# Altium schematic sheet Power2.schdoc
size 420 x 298 mm; Symbol: Sheet-Symbol_A4; Company: 嘉立创EDA; Version: V1.0; Page Size: A4; @Project Name: prj_extend_and_core_board; @Page Count: 7; @Update Date: 2024-07-05; @Create Date: 2024-06-16; @Schematic Name: Schematic1; @Page No: 7; @Page Name: Power2; Device: Sheet-Symbol_A4
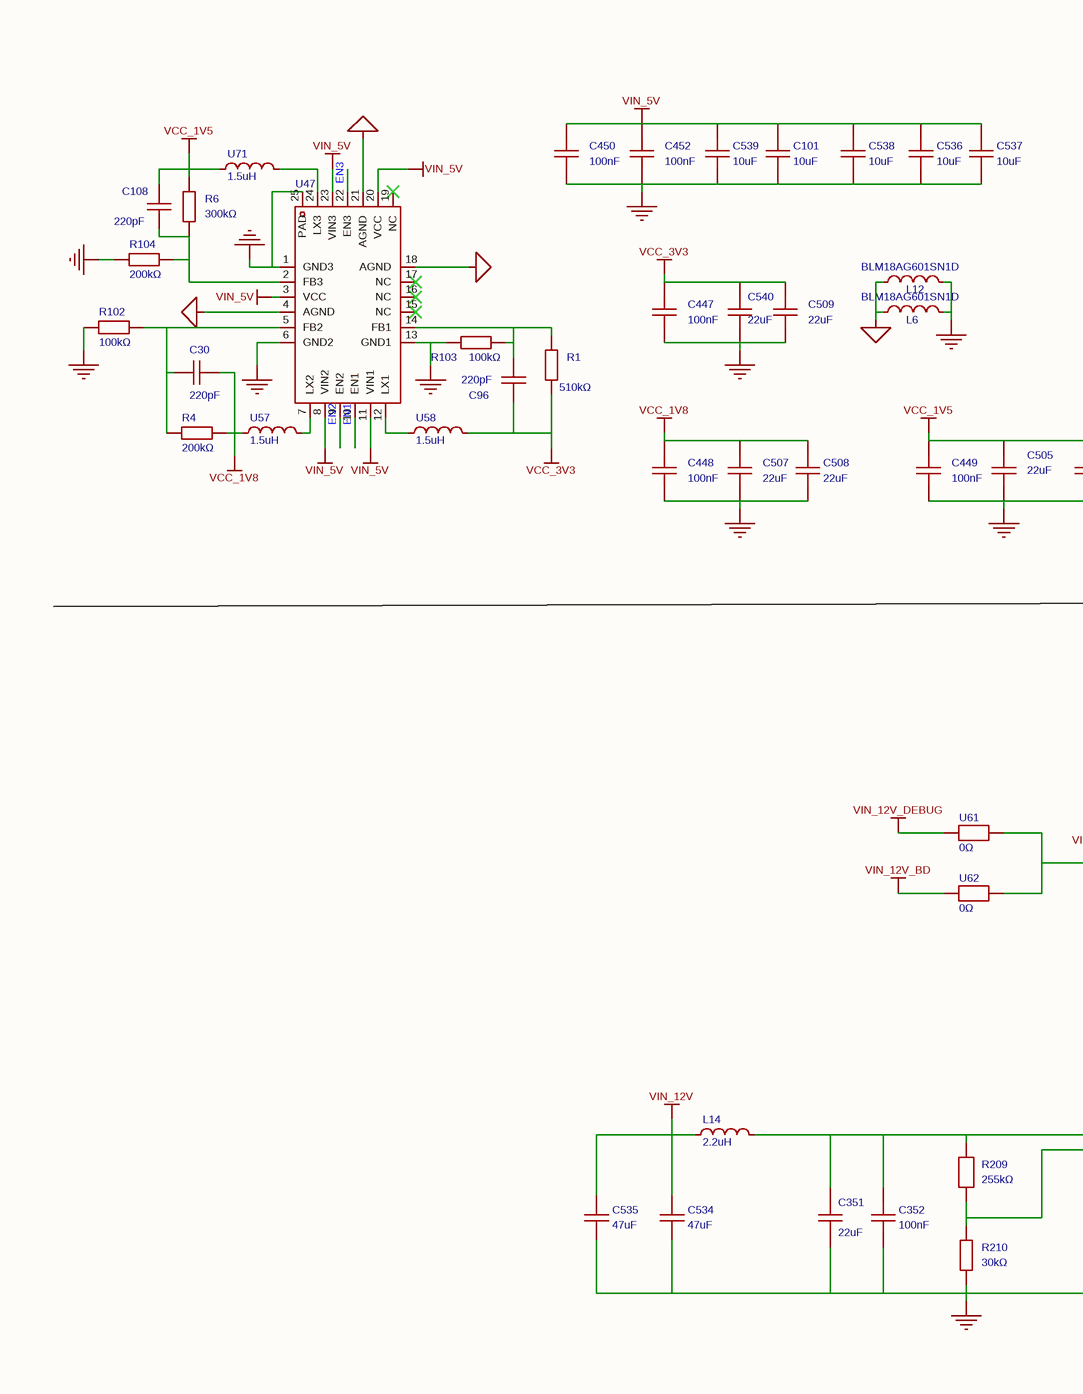
[diagram p0: Power2.schdoc, left]
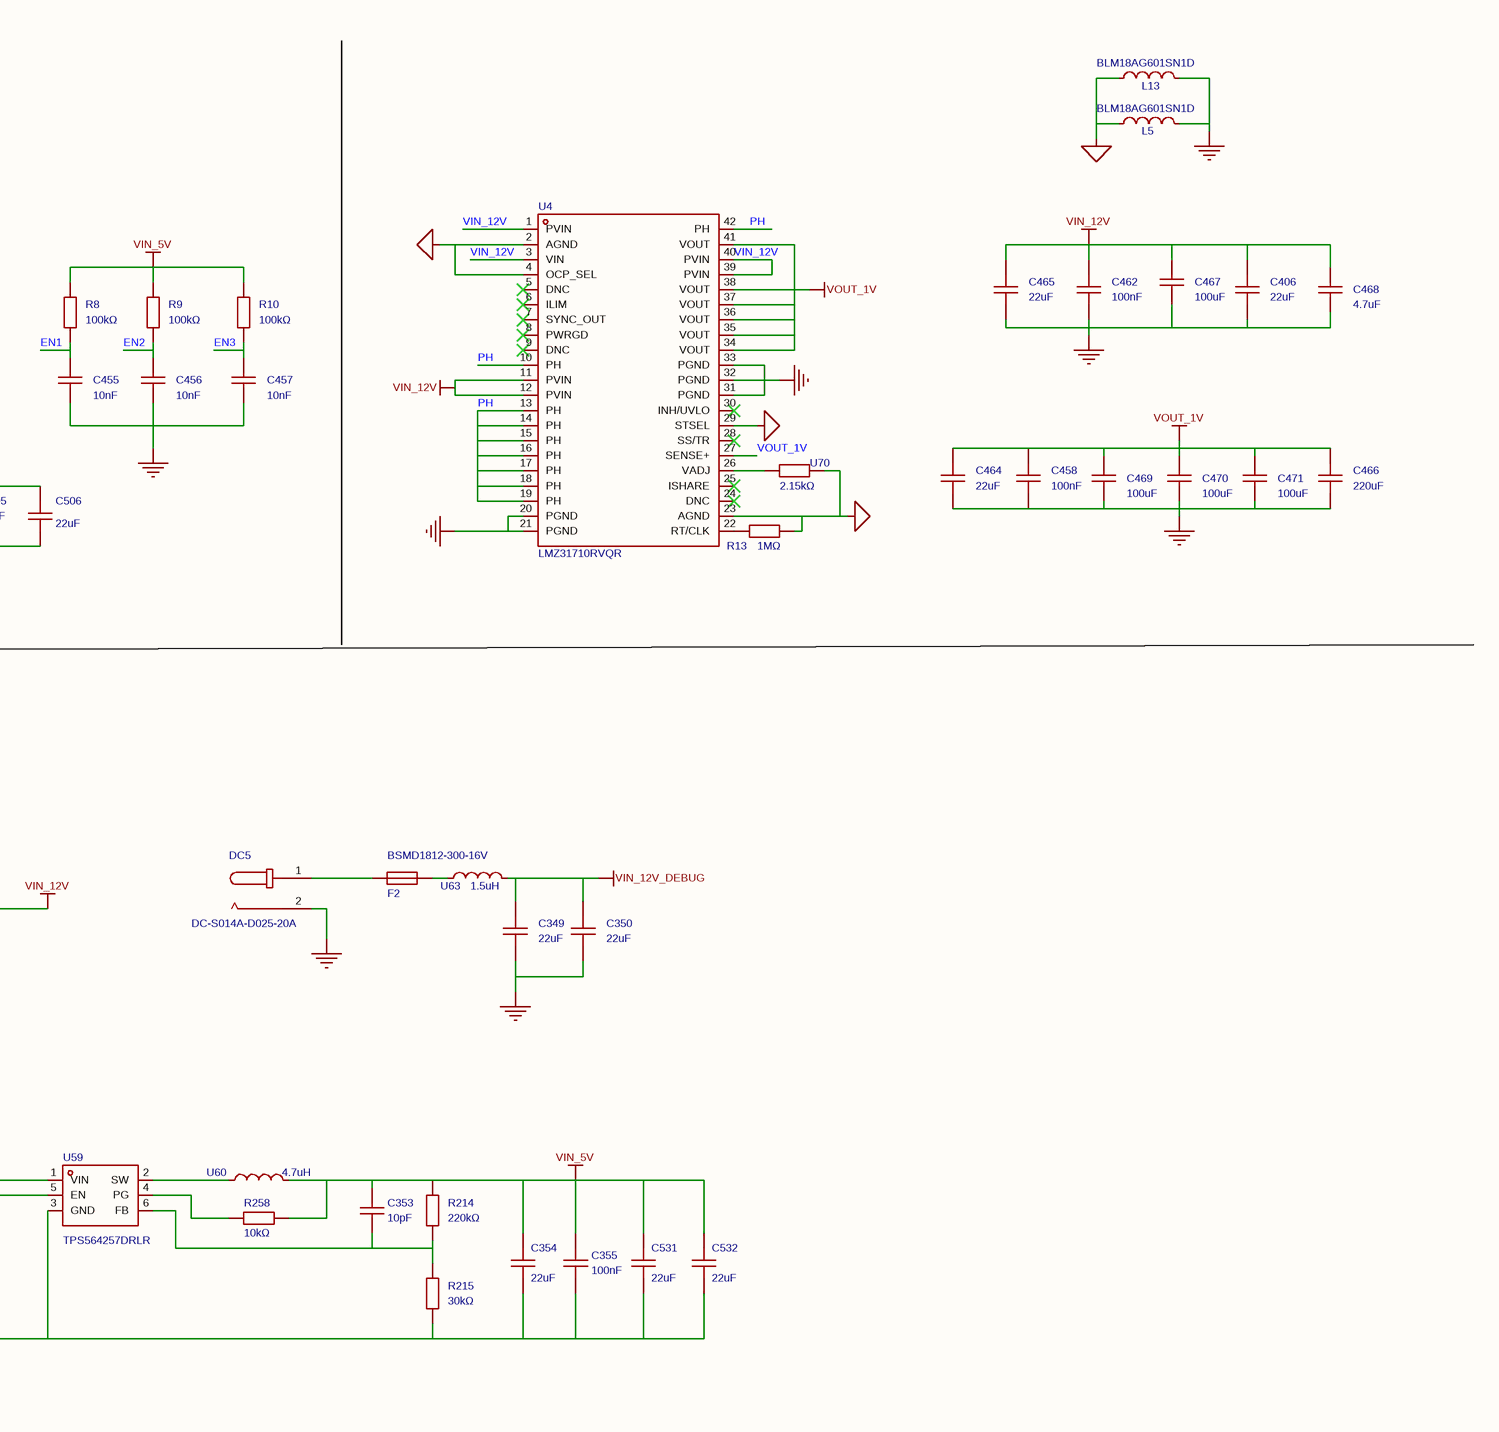
[diagram p1: Power2.schdoc, right]

## Parts
C30  220pF  [C0402]
C96  220pF  [C0402]
C101  10uF  [C0603]
C108  220pF  [C0402]
C349  22uF  [C0805]
C350  22uF  [C0805]
C351  22uF  [C0805]
C352  100nF  [C0603]
C353  10pF  [C0603]
C354  22uF  [C0805]
C355  100nF  [C0603]
C406  22uF  [C0805]
C447  100nF  [C0402]
C448  100nF  [C0402]
C449  100nF  [C0402]
C450  100nF  [C0402]
C452  100nF  [C0402]
C455  10nF  [C0402]
C456  10nF  [C0402]
C457  10nF  [C0402]
C458  100nF  [C0402]
C462  100nF  [C0402]
C464  22uF  [C0603]
C465  22uF  [C0805]
C466  220uF  [C1206]
C467  100uF  [C1206]
C468  4.7uF  [C0603]
C469  100uF  [C1206]
C470  100uF  [C1206]
C471  100uF  [C1206]
C505  22uF  [C0805]
C506  22uF  [C0805]
C507  22uF  [C0805]
C508  22uF  [C0805]
C509  22uF  [C0805]
C531  22uF  [C0805]
C532  22uF  [C0805]
C534  47uF  [C0603]
C535  47uF  [C0603]
C536  10uF  [C0603]
C537  10uF  [C0603]
C538  10uF  [C0603]
C539  10uF  [C0603]
C540  22uF  [C0805]
DC5  DC-S014A-D025-20A  [DC-IN-TH_DC-S014A-D025-20A]
F2  BSMD1812-300-16V  [F1812]
L5  BLM18AG601SN1D  [L0603]
L6  BLM18AG601SN1D  [L0603]
L12  BLM18AG601SN1D  [L0603]
L13  BLM18AG601SN1D  [L0603]
L14  2.2uH  [IND-SMD_L2.5-W2.0_FWP252012P-2R2ML]
R1  510kΩ  [R0603]
R4  200kΩ  [R0603]
R6  300kΩ  [R0603]
R8  100kΩ  [R0402]
R9  100kΩ  [R0402]
R10  100kΩ  [R0402]
R13  1MΩ  [R0603]
R102  100kΩ  [R0603]
R103  100kΩ  [R0603]
R104  200kΩ  [R0603]
R209  255kΩ  [R0805]
R210  30kΩ  [R0805]
R214  220kΩ  [R0805]
R215  30kΩ  [R0805]
R258  10kΩ  [R0603]
U4  LMZ31710RVQR  [B3QFN-42_L10.0-W10.0-P0.80-TL-EP]
U47  EA3059C  [QFN-24_L4.0-W4.0-P0.50-BL-EP2.6]  (value not drawn)
U57  1.5uH  [IND-SMD_L2.5-W2.0_YXMBL252010P]
U58  1.5uH  [IND-SMD_L2.5-W2.0_YXMBL252010P]
U59  TPS564257DRLR  [SOT-563-6_L1.6-W1.2-P0.5-LS1.6-BR]
U60  4.7uH  [IND-SMD_L2.5-W2.0-VLS252012CX-150M]
U61  0Ω  [R1812]
U62  0Ω  [R1812]
U63  1.5uH  [IND-SMD_L2.5-W2.0_YXMBL252010P]
U70  2.15kΩ  [R0603]
U71  1.5uH  [IND-SMD_L2.5-W2.0_YXMBL252010P]

## Nets
AGND: L5.1 L6.1 L12.1 L13.1 R13.2 U4.2(AGND) U4.4(OCP_SEL) U4.23(AGND) U4.29(STSEL) U47.4(AGND) U47.18(AGND) U47.21(AGND) U70.2
GND: C101.1 C349.1 C350.1 C351.1 C352.1 C354.1 C355.1 C406.1 C447.1 C448.1 C449.1 C450.1 C452.1 C455.1 C456.1 C457.1 C458.1 C462.1 C464.1 C465.1 C466.1 C467.1 C468.1 C469.1 C470.1 C471.1 C505.1 C506.1 C507.1 C508.1 C509.1 C531.1 C532.1 C534.1 C535.1 C536.1 C537.1 C538.1 C539.1 C540.1 DC5.2 L5.2 L6.2 L12.2 L13.2 R102.1 R103.1 R104.1 R210.1 R215.1 U4.20(PGND) U4.21(PGND) U4.31(PGND) U4.32(PGND) U4.33(PGND) U47.1(GND3) U47.6(GND2) U47.13(GND1) U47.25(PAD) U59.3(GND)
VCC_1V5: C108.1 C449.2 C505.2 C506.2 R6.2 U71.1
VCC_1V8: C30.1 C448.2 C507.2 C508.2 R4.2 U57.1
VCC_3V3: C96.1 C447.2 C509.2 C540.2 R1.1 U58.2
VIN_5V: C101.2 C353.2 C354.2 C355.2 C450.2 C452.2 C531.2 C532.2 C536.2 C537.2 C538.2 C539.2 R8.2 R9.2 R10.2 R214.2 R258.2 U47.3(VCC) U47.8(VIN2) U47.11(VIN1) U47.20(VCC) U47.23(VIN3) U60.2
VIN_12V: C406.2 C462.2 C465.2 C467.2 C468.2 C534.2 C535.2 L14.1 U4.1(PVIN) U4.3(VIN) U4.11(PVIN) U4.12(PVIN) U4.39(PVIN) U4.40(PVIN) U61.2 U62.2
VIN_12V_BD: U62.1
VIN_12V_DEBUG: C349.2 C350.2 U61.1 U63.2
VOUT_1V: C458.2 C464.2 C466.2 C469.2 C470.2 C471.2 U4.27(SENSE+) U4.34(VOUT) U4.35(VOUT) U4.36(VOUT) U4.37(VOUT) U4.38(VOUT) U4.41(VOUT)
EN1: C455.2 R8.1 U47.10(EN1)
EN2: C456.2 R9.1 U47.9(EN2)
EN3: C457.2 R10.1 U47.22(EN3)
PH: U4.10(PH) U4.13(PH) U4.14(PH) U4.15(PH) U4.16(PH) U4.17(PH) U4.18(PH) U4.19(PH) U4.42(PH)
NetC30_2: C30.2 R4.1 R102.2 U47.5(FB2)
NetC96_2: C96.2 R1.2 R103.2 U47.14(FB1)
NetC108_2: C108.2 R6.1 R104.2 U47.2(FB3)
NetC351_2: C351.2 C352.2 L14.2 R209.2 U59.1(VIN)
NetC353_1: C353.1 R214.1 R215.2 U59.6(FB)
NetDC5_1: DC5.1 F2.1
NetF2_2: F2.2 U63.1
NetR13_1: R13.1 U4.22(RT/CLK)
NetR209_1: R209.1 R210.2 U59.5(EN)
NetR258_1: R258.1 U59.4(PG)
NetU4_26: U4.26(VADJ) U70.1
NetU47_7: U47.7(LX2) U57.2
NetU47_12: U47.12(LX1) U58.1
NetU47_24: U47.24(LX3) U71.2
NetU59_2: U59.2(SW) U60.1

Not connected (* = marked no-connect by the designer): U4 5(DNC)* 6(ILIM)* 7(SYNC_OUT)* 8(PWRGD)* 9(DNC)* 24(DNC)* 25(ISHARE)* 28(SS/TR)* 30(INH/UVLO)*; U47 15(NC)* 16(NC)* 17(NC)* 19(NC)*

## Notes on the sheet
- 1
- 2
- 3
- 4
- 5
- 6
- A
- B
- C
- 更新日期
- 2024-07-05
- D
- 原理图
- 图页
- Schematic1
- Power2
- 创建日期
- 物料编码
- 2024-06-16
- 审阅
- 绘制
- prj_extend_and_core_board
- 版本
- V1.0
- 尺寸
- A4
- 页
- 7
- 嘉立创EDA
- 共

## Library data of the parts
C30 C96 C108 = 0402B221K500NT: 容值:220pF;精度:±10%;额定电压:50V;材质(温度系数):X7R;; Manufacturer: FH(风华); AddInBom: yes; ModelId: 36a51122f27c49738f86b3bfa98863e0; ModelName: C0402_L1.0-W0.5-H0.5; ModelTransform: 39.37,19.685,0,0,0,0,0,0,0; Tolerance: ±10%; Voltage Rated: 50V; Temperature Coefficient: X7R; Symbol: 0402B221K500NT; Device: 0402B221K500NT; LCSC Part Name: 220pF ±10% 50V; SupplierPart: C1530; ManufacturerPart: 0402B221K500NT; Supplier Footprint: 0402; JLCPCB Part Class: 基础库; Datasheet: https://atta.szlcsc.com/upload/public/pdf/source/20200305/C486355_26A10D38EF8C2A5C37091D0039909270.pdf; Supplier: LCSC; ConvertToPcb: yes; FootprintName: C0402; Value: 220pF
C101 C536-C539 = CL10A106KP8NNNC: 容值:10uF;精度:±10%;额定电压:10V;材质(温度系数):X5R;; Manufacturer: SAMSUNG(三星); AddInBom: yes; ModelId: ac125912035d415993ca9572d50418b1; ModelName: C0603_L1.6-W0.8-H0.8; ModelTransform: 62.992,31.496,0,0,0,0,0,0,0; Tolerance: ±10%; Voltage Rated: 10V; Temperature Coefficient: X5R; Symbol: CL10A106KP8NNNC; Device: CL10A106KP8NNNC; Supplier: LCSC; Manufacturer Part: CL10A106KP8NNNC; Value: 10uF; Supplier Part: C19702; JLCPCB Part Class: 基础库; LCSC Part Name: 10uF ±10% 10V; Supplier Footprint: 0603; Datasheet: https://atta.szlcsc.com/upload/public/pdf/source/20160218/1457707763339.pdf; ConvertToPcb: yes; FootprintName: C0603
C349-C351 C354 C406 C465 C531 C532 = CL21A226MAQNNNE: 容值:22uF;精度:±20%;额定电压:25V;材质(温度系数):X5R;; Manufacturer: SAMSUNG(三星); AddInBom: yes; ModelId: 1ba041120af144c991958decab20d241; ModelName: C0805_L2.0-W1.3-H1.3; ModelTransform: 78.74,51.181,0,0,0,0,0,0.0005,0; Tolerance: ±20%; Voltage Rated: 25V; Temperature Coefficient: X5R; Symbol: CL21A226MAQNNNE; Device: CL21A226MAQNNNE; LCSC Part Name: 22uF ±20% 25V; SupplierPart: C45783; ManufacturerPart: CL21A226MAQNNNE; Supplier Footprint: 0805; JLCPCB Part Class: 基础库; Datasheet: https://atta.szlcsc.com/upload/public/pdf/source/20160218/1457707763339.pdf; Supplier: LCSC; ConvertToPcb: yes; FootprintName: C0805; Value: 22uF
C352 C355 = CC0603KRX7R9BB104: 容值:100nF;精度:±10%;额定电压:50V;材质(温度系数):X7R;; Manufacturer: YAGEO(国巨); AddInBom: yes; ModelId: ac125912035d415993ca9572d50418b1; ModelName: C0603_L1.6-W0.8-H0.8; ModelTransform: 62.992,31.496,0,0,0,0,0,0,0; Tolerance: ±10%; Voltage Rated: 50V; Temperature Coefficient: X7R; Symbol: CC0603KRX7R9BB104; Device: CC0603KRX7R9BB104; Supplier: LCSC; Manufacturer Part: CC0603KRX7R9BB104; Value: 100nF; Supplier Part: C14663; JLCPCB Part Class: Basic Part; LCSC Part Name: 100nF ±10% 50V; Supplier Footprint: 0603; Datasheet: https://atta.szlcsc.com/upload/public/pdf/source/20180910/C282072_33301C7F631E79921B82A8DAC6BCC5B3.pdf; ConvertToPcb: yes; FootprintName: C0603
C353 = CL10C100JB8NNNC: 容值:10pF;精度:±5%;额定电压:50V;材质(温度系数):C0G;; Manufacturer: SAMSUNG(三星); AddInBom: yes; ModelId: ac125912035d415993ca9572d50418b1; ModelName: C0603_L1.6-W0.8-H0.8; ModelTransform: 62.992,31.496,0,0,0,0,0,0,0; Tolerance: ±5%; Voltage Rated: 50V; Temperature Coefficient: C0G; Symbol: CL10C100JB8NNNC; Device: CL10C100JB8NNNC; Supplier: LCSC; Manufacturer Part: CL10C100JB8NNNC; Value: 10pF; Supplier Part: C1634; JLCPCB Part Class: 基础库; LCSC Part Name: 10pF ±5% 50V; Supplier Footprint: 0603; Datasheet: https://atta.szlcsc.com/upload/public/pdf/source/20160218/1457707763339.pdf; ConvertToPcb: yes; FootprintName: C0603
C447-C450 C452 C458 C462 = GRM155R71H104KE14D: 容值:100nF;精度:±10%;额定电压:50V;材质(温度系数):X7R;; Manufacturer: muRata(村田); AddInBom: yes; ModelId: 36a51122f27c49738f86b3bfa98863e0; ModelName: C0402_L1.0-W0.5-H0.5; ModelTransform: 39.37,19.685,0,0,0,0,0,0,0; Tolerance: ±10%; Voltage Rated: 50V; Temperature Coefficient: X7R; Symbol: GRM155R71H104KE14D; Device: GRM155R71H104KE14D; Supplier: LCSC; Manufacturer Part: GRM155R71H104KE14D; Value: 100nF; Supplier Part: C77020; JLCPCB Part Class: 扩展库; LCSC Part Name: 100nF ±10% 50V; Supplier Footprint: 0402; Datasheet: https://atta.szlcsc.com/upload/public/pdf/source/20180326/C77020_39BD49C951FF1AF0DB1F1FAC5AC1E401.pdf; ConvertToPcb: yes; FootprintName: C0402
C455-C457 = CC0402KRX7R9BB103: 容值:10nF;精度:±10%;额定电压:50V;材质(温度系数):X7R;; Manufacturer: YAGEO(国巨); AddInBom: yes; ModelId: 36a51122f27c49738f86b3bfa98863e0; ModelName: C0402_L1.0-W0.5-H0.5; ModelTransform: 39.37,19.685,0,0,0,0,0,0,0; Tolerance: ±10%; Voltage Rated: 50V; Temperature Coefficient: X7R; Symbol: CC0402KRX7R9BB103; Device: CC0402KRX7R9BB103; Supplier: LCSC; Manufacturer Part: CC0402KRX7R9BB103; Value: 10nF; Supplier Part: C60133; JLCPCB Part Class: 扩展库; LCSC Part Name: 10nF ±10% 50V; Supplier Footprint: 0402; Datasheet: https://atta.szlcsc.com/upload/public/pdf/source/20180224/C181747_15194369449651363981.pdf; ConvertToPcb: yes; FootprintName: C0402
C464 = CL10A226MQ8NRNC: 容值:22uF;精度:±20%;额定电压:6.3V;材质(温度系数):X5R;; Manufacturer: SAMSUNG(三星); AddInBom: yes; ModelId: ac125912035d415993ca9572d50418b1; ModelName: C0603_L1.6-W0.8-H0.8; ModelTransform: 62.992,31.496,0,0,0,0,0,0,0; Tolerance: ±20%; Voltage Rated: 6.3V; Temperature Coefficient: X5R; Symbol: CL10A226MQ8NRNC; Device: CL10A226MQ8NRNC; LCSC Part Name: 22uF ±20% 6.3V; SupplierPart: C59461; ManufacturerPart: CL10A226MQ8NRNC; Supplier Footprint: 0603; JLCPCB Part Class: 基础库; Datasheet: https://atta.szlcsc.com/upload/public/pdf/source/20160218/1457707763339.pdf; Supplier: LCSC; ConvertToPcb: yes; FootprintName: C0603; Value: 22uF
C466 = GRM31CR60J227ME11L: 容值:220uF;精度:±20%;额定电压:6.3V;材质(温度系数):X5R;; Manufacturer: muRata(村田); AddInBom: yes; ModelId: e4be705b945545a48e666415e3682bd8; ModelName: C1206_L3.2-W1.6-H1.3; ModelTransform: 125.984,62.992,0,0,0,0,0,0,0; Tolerance: ±20%; Voltage Rated: 6.3V; Temperature Coefficient: X5R; Symbol: GRM31CR60J227ME11L; Device: GRM31CR60J227ME11L; LCSC Part Name: 220uF ±20% 6.3V; SupplierPart: C412252; ManufacturerPart: GRM31CR60J227ME11L; Supplier Footprint: 1206; JLCPCB Part Class: 扩展库; Datasheet: https://atta.szlcsc.com/upload/public/pdf/source/20190904/C426118_85E81C7C1F21FC87C5FB6D536E0847B4.pdf; Supplier: LCSC; ConvertToPcb: yes; FootprintName: C1206; Value: 220uF
C467 C469-C471 = CL31A107MQHNNNE: 容值:100uF;精度:±20%;额定电压:6.3V;材质(温度系数):X5R;; Manufacturer: SAMSUNG(三星); AddInBom: yes; ModelId: e4be705b945545a48e666415e3682bd8; ModelName: C1206_L3.2-W1.6-H1.3; ModelTransform: 125.984,62.992,0,0,0,0,0,0,0; Tolerance: ±20%; Voltage Rated: 6.3V; Temperature Coefficient: X5R; Symbol: CL31A107MQHNNNE; Device: CL31A107MQHNNNE; Supplier: LCSC; Manufacturer Part: CL31A107MQHNNNE; Value: 100uF; Supplier Part: C15008; JLCPCB Part Class: 基础库; LCSC Part Name: 100uF ±20% 6.3V; Supplier Footprint: 1206; Datasheet: https://atta.szlcsc.com/upload/public/pdf/source/20160218/1457707763339.pdf; ConvertToPcb: yes; FootprintName: C1206
C468 = CL10A475KO8NNNC: 容值:4.7uF;精度:±10%;额定电压:16V;材质(温度系数):X5R;; Manufacturer: SAMSUNG(三星); AddInBom: yes; ModelId: ac125912035d415993ca9572d50418b1; ModelName: C0603_L1.6-W0.8-H0.8; ModelTransform: 62.992,31.496,0,0,0,0,0,0,0; Tolerance: ±10%; Voltage Rated: 16V; Temperature Coefficient: X5R; Symbol: CL10A475KO8NNNC; Device: CL10A475KO8NNNC; Supplier: LCSC; Manufacturer Part: CL10A475KO8NNNC; Value: 4.7uF; Supplier Part: C19666; JLCPCB Part Class: 基础库; LCSC Part Name: 4.7uF ±10% 16V; Supplier Footprint: 0603; Datasheet: https://atta.szlcsc.com/upload/public/pdf/source/20160218/1457707763339.pdf; ConvertToPcb: yes; FootprintName: C0603
C505-C509 C540 = C2012X5R1A226MT0J0E: 容值:22uF;精度:±20%;额定电压:10V;材质(温度系数):X5R;; Manufacturer: TDK; AddInBom: yes; ModelId: 1ba041120af144c991958decab20d241; ModelName: C0805_L2.0-W1.3-H1.3; ModelTransform: 78.74,51.181,0,0,0,0,0,0.0005,0; Tolerance: ±20%; Voltage Rated: 10V; Temperature Coefficient: X5R; Symbol: C2012X5R1A226MT0J0E; Device: C2012X5R1A226MT0J0E; LCSC Part Name: 22uF ±20% 10V; SupplierPart: C361180; ManufacturerPart: C2012X5R1A226MT0J0E; Supplier Footprint: 0805; JLCPCB Part Class: 扩展库; Datasheet: https://atta.szlcsc.com/upload/public/pdf/source/20190612/C361180_85CC9FB0751BEA97238DE56AB4AF0B1F.pdf; Supplier: LCSC; ConvertToPcb: yes; FootprintName: C0805; Value: 22uF
C534 C535 = GRM188R60J476ME15D: 容值:47uF;精度:±20%;额定电压:6.3V;材质(温度系数):X5R;; Manufacturer: muRata(村田); AddInBom: yes; ModelId: ac125912035d415993ca9572d50418b1; ModelName: C0603_L1.6-W0.8-H0.8; ModelTransform: 62.992,31.496,0,0,0,0,0,0,0; Tolerance: ±20%; Voltage Rated: 6.3V; Temperature Coefficient: X5R; Symbol: GRM188R60J476ME15D; Device: GRM188R60J476ME15D; Supplier: LCSC; Manufacturer Part: GRM188R60J476ME15D; Value: 47uF; Supplier Part: C140782; JLCPCB Part Class: 扩展库; LCSC Part Name: 47uF ±20% 6.3V; Supplier Footprint: 0603; Datasheet: https://atta.szlcsc.com/upload/public/pdf/source/20171113/C140782_15105612981581115778.pdf; ConvertToPcb: yes; FootprintName: C0603
DC5 = DC-S014A-D025-20A: 连接器类型:DC电源插座;安装方式:弯插;触点内径:2.5mm;触点外径:5.7mm;额定电流:20A;额定电压:30V;工作温度范围:-40℃~+85℃;; Manufacturer: G-Switch(品赞); AddInBom: yes; ModelId: f36250d2cb014c5b9ccd59da1ea0661a; ModelTransform: 393.7,572.8335,0,0,0,0,0,-45.276,-78.74; Connector Type: DC电源插座; Inside Contact Diameter: 2.5mm; Outside Contact Diameter: 5.7mm; Current Rating (Max): 20A; Voltage Rating (Max): 30V; Symbol: DC-S014A-D025-20A; Device: DC-S014A-D025-20A; LCSC Part Name: DC电源插座 内径:2.5mm 外径:5.7mm; SupplierPart: C7464928; ManufacturerPart: DC-S014A-D025-20A; Supplier Footprint: 插件; JLCPCB Part Class: 扩展库; Datasheet: https://atta.szlcsc.com/upload/public/pdf/source/20230721/7022BD79D739A295370DA3111F29A74C.pdf; Supplier: LCSC; ConvertToPcb: yes; FootprintName: DC-IN-TH_DC-S014A-D025-20A; ModelName: DC-IN-TH_DC-S014A-D025-20A; Mounting Style: 弯插; Operating Temperature Range: -40℃~+85℃
F2 = BSMD1812-300-16V: 最大电压:16V;最大电流:40A;保持电流:3A;跳闸电流:6A;; Manufacturer: BHFUSE(佰宏); AddInBom: yes; ModelId: bca21e458c564d38b781621ca22e660b; ModelName: F1812_L4.5-W3.2-H1.0; ModelTransform: 177.165,125.984,0,0,0,0,0.0005,0,0; Operating Voltage (Max): 16V; Current Rating (Max): 40A; Hold Current: 3A; Trip Current: 6A; Power Dissipation: 1.4W; Resistance - Initial (Ri) (Min): 10mΩ; Resistance - Post Trip (R1) (Max): 40mΩ; Maximum Time to Trip: 4s; Symbol: BSMD1812-300-16V; Device: BSMD1812-300-16V; Supplier: LCSC; Supplier Part: C883162; Manufacturer Part: BSMD1812-300-16V; JLCPCB Part Class: 扩展库; LCSC Part Name: 16V 3A 1812自恢复; Supplier Footprint: 1812; Datasheet: https://atta.szlcsc.com/upload/public/pdf/source/20230512/6ED7FF50F668B3AF958C55F12246A840.pdf; ConvertToPcb: yes; FootprintName: F1812; Operating Temperature: -40℃~+85℃
L5 L6 L12 L13 = BLM18AG601SN1D: 标称阻抗@测试频率:600Ω@100MHz;误差:±25%;直流电阻(RDC):380mΩ;; Manufacturer: muRata(村田); AddInBom: yes; ModelId: 2bc5ec593d464d6ba9807aec0b5673c2; ModelName: L0603_L1.6-W0.8-H0.5_BEAD; ModelTransform: 62.992,31.496,0,180,0,0,0.094,0.629,0; Tolerance: ±25%; DC Resistance: 380mΩ; Current Rating: 500mA; Circuits: 1; Symbol: BLM18AG601SN1D; Device: BLM18AG601SN1D; LCSC Part Name: 单路 0603磁珠 阻抗600Ω@100MHz; SupplierPart: C19330; ManufacturerPart: BLM18AG601SN1D; Supplier Footprint: 0603; JLCPCB Part Class: 扩展库; Datasheet: https://atta.szlcsc.com/upload/public/pdf/source/20180329/C160981_FD3C2D2622A377E203B89F4AA32B0741.pdf; Supplier: LCSC; ConvertToPcb: yes; FootprintName: L0603; Impedance @ Frequency: 600Ω@100MHz
L14 = FWP252012P-2R2ML: 电感值:2.2uH;精度:±20%;额定电流:2.27A;饱和电流(Isat):3A;类型:一体成型电感;; Manufacturer: cjiang(长江微电); AddInBom: yes; Tolerance: ±20%; Rated Current: 2.27A; Saturation Current (Isat): 3A; DC Resistance (DCR): 85mΩ; Type: 一体成型电感; Symbol: FWP252012P-2R2ML; Device: FWP252012P-2R2ML; LCSC Part Name: 2.2uH ±20% 3A; SupplierPart: C5179446; ManufacturerPart: FWP252012P-2R2ML; Supplier Footprint: 1008; JLCPCB Part Class: 扩展库; Datasheet: https://atta.szlcsc.com/upload/public/pdf/source/20220919/E6AE7D8D9E70B41ECAF510F598F800B9.pdf; Supplier: LCSC; ConvertToPcb: yes; FootprintName: IND-SMD_L2.5-W2.0_FWP252012P-2R2ML; Value: 2.2uH
R1 = 0603WAF5103T5E: 电阻类型:厚膜电阻;阻值:510kΩ;精度:±1%;功率:100mW;最大工作电压:75V;温度系数:±100ppm/℃;; Manufacturer: UNI-ROYAL(厚声); AddInBom: yes; ModelId: fc143cca1e79419f9cd78b61e9279f08; ModelTransform: 31.8897,63.7794,0,90,0,0,0,0,0; Tolerance: ±1%; Power(Watts): 100mW; Overload Voltage (Max): 75V; Symbol: 0603WAF5103T5E; Device: 0603WAF5103T5E; Supplier: LCSC; Manufacturer Part: 0603WAF5103T5E; Supplier Part: C23192; Value: 510kΩ; JLCPCB Part Class: 基础库; LCSC Part Name: 510kΩ ±1% 100mW 厚膜电阻; Supplier Footprint: 0603; Datasheet: https://atta.szlcsc.com/upload/public/pdf/source/20200306/C422600_1E6D84923E4A46A82E41ADD87F860B5C.pdf; ConvertToPcb: yes; FootprintName: R0603; ModelName: R0603; Type: 厚膜电阻; Temperature Coefficient: ±100ppm/℃; Operating Temperature Range: -55℃~+155℃
R4 R104 = 0603WAF2003T5E: 电阻类型:厚膜电阻;阻值:200kΩ;精度:±1%;功率:100mW;最大工作电压:75V;温度系数:±100ppm/℃;; Manufacturer: UNI-ROYAL(厚声); AddInBom: yes; ModelId: fc143cca1e79419f9cd78b61e9279f08; ModelTransform: 31.8897,63.7794,0,90,0,0,0,0,0; Tolerance: ±1%; Power(Watts): 100mW; Overload Voltage (Max): 75V; Symbol: 0603WAF2003T5E; Device: 0603WAF2003T5E; Supplier: LCSC; Manufacturer Part: 0603WAF2003T5E; Supplier Part: C25811; Value: 200kΩ; JLCPCB Part Class: 基础库; LCSC Part Name: 200kΩ ±1% 100mW 厚膜电阻; Supplier Footprint: 0603; Datasheet: https://atta.szlcsc.com/upload/public/pdf/source/20200306/C422600_1E6D84923E4A46A82E41ADD87F860B5C.pdf; ConvertToPcb: yes; FootprintName: R0603; ModelName: R0603; Type: 厚膜电阻; Temperature Coefficient: ±100ppm/℃; Operating Temperature Range: -55℃~+155℃
R6 = 0603WAF3003T5E: 电阻类型:厚膜电阻;阻值:300kΩ;精度:±1%;功率:100mW;最大工作电压:75V;温度系数:±100ppm/℃;; Manufacturer: UNI-ROYAL(厚声); AddInBom: yes; ModelId: fc143cca1e79419f9cd78b61e9279f08; ModelTransform: 31.8897,63.7794,0,90,0,0,0,0,0; Tolerance: ±1%; Power(Watts): 100mW; Overload Voltage (Max): 75V; Symbol: 0603WAF3003T5E; Device: 0603WAF3003T5E; Supplier: LCSC; Manufacturer Part: 0603WAF3003T5E; Supplier Part: C23024; Value: 300kΩ; JLCPCB Part Class: 基础库; LCSC Part Name: 300kΩ ±1% 100mW 厚膜电阻; Supplier Footprint: 0603; Datasheet: https://atta.szlcsc.com/upload/public/pdf/source/20200306/C422600_1E6D84923E4A46A82E41ADD87F860B5C.pdf; ConvertToPcb: yes; FootprintName: R0603; ModelName: R0603; Type: 厚膜电阻; Temperature Coefficient: ±100ppm/℃; Operating Temperature Range: -55℃~+155℃
R8-R10 = RC0402FR-07100KL: 电阻类型:厚膜电阻;阻值:100kΩ;精度:±1%;功率:62.5mW;最大工作电压:50V;温度系数:±100ppm/℃;; Manufacturer: YAGEO(国巨); AddInBom: yes; ModelId: 671aefced39d4c318694bba8bd8efd39; ModelName: R0402_L1.0-W0.5-H0.5; ModelTransform: 39.37,19.685,0,0,0,0,0,0.0005,0; Tolerance: ±1%; Power(Watts): 62.5mW; Overload Voltage (Max): 50V; Symbol: RC0402FR-07100KL; Device: RC0402FR-07100KL; LCSC Part Name: 厚膜电阻 100kΩ ±1% 62.5mW; SupplierPart: C60491; ManufacturerPart: RC0402FR-07100KL; Supplier Footprint: 0402; JLCPCB Part Class: 扩展库; Datasheet: https://atta.szlcsc.com/upload/public/pdf/source/20180927/C295883_E8D83085EA81BD7DE0B2B681138C15EE.pdf; Supplier: LCSC; ConvertToPcb: yes; FootprintName: R0402; Type: 厚膜电阻; Value: 100kΩ; Temperature Coefficient: ±100ppm/℃; Operating Temperature Range: -55℃~+155℃
R13 = 0603WAF1004T5E: 电阻类型:厚膜电阻;阻值:1MΩ;精度:±1%;功率:100mW;最大工作电压:75V;温度系数:±100ppm/℃;; Manufacturer: UNI-ROYAL(厚声); AddInBom: yes; ModelId: fc143cca1e79419f9cd78b61e9279f08; ModelTransform: 31.8897,63.7794,0,90,0,0,0,0,0; Tolerance: ±1%; Power(Watts): 100mW; Overload Voltage (Max): 75V; Symbol: 0603WAF1004T5E; Device: 0603WAF1004T5E; Supplier: LCSC; Manufacturer Part: 0603WAF1004T5E; Supplier Part: C22935; Value: 1MΩ; JLCPCB Part Class: 基础库; LCSC Part Name: 1MΩ ±1% 100mW 厚膜电阻; Supplier Footprint: 0603; Datasheet: https://atta.szlcsc.com/upload/public/pdf/source/20200306/C422600_1E6D84923E4A46A82E41ADD87F860B5C.pdf; ConvertToPcb: yes; FootprintName: R0603; ModelName: R0603; Type: 厚膜电阻; Temperature Coefficient: ±100ppm/℃; Operating Temperature Range: -55℃~+155℃
R102 R103 = RT0603BRD07100KL: 电阻类型:薄膜电阻;阻值:100kΩ;精度:±0.1%;功率:100mW;最大工作电压:75V;温度系数:±25ppm/℃;; Manufacturer: YAGEO(国巨); AddInBom: yes; ModelId: fc143cca1e79419f9cd78b61e9279f08; ModelTransform: 31.8897,63.7794,0,90,0,0,0,0,0; Tolerance: ±0.1%; Power(Watts): 100mW; Overload Voltage (Max): 75V; Symbol: RT0603BRD07100KL; Device: RT0603BRD07100KL; LCSC Part Name: 薄膜电阻 100kΩ ±0.1% 100mW; SupplierPart: C122538; ManufacturerPart: RT0603BRD07100KL; Supplier Footprint: 0603; JLCPCB Part Class: 扩展库; Datasheet: https://atta.szlcsc.com/upload/public/pdf/source/20170721/C122538_1500619326323834092.pdf; Supplier: LCSC; ConvertToPcb: yes; FootprintName: R0603; ModelName: R0603; Type: 薄膜电阻; Value: 100kΩ; Temperature Coefficient: ±25ppm/℃; Operating Temperature Range: -55℃~+155℃
R209 = FRC0805F2553TS: 电阻类型:厚膜电阻;阻值:255kΩ;精度:±1%;功率:125mW;最大工作电压:150V;温度系数:±100ppm/℃;; Manufacturer: FOJAN(富捷); AddInBom: yes; ModelId: 37a81e68749a4138bd2dfa6897b24b85; ModelName: R0805_L2.0-W1.3-H0.6; ModelTransform: 78.74,51.181,0,0,0,0,0,-0.0005,0; Tolerance: ±1%; Power(Watts): 125mW; Overload Voltage (Max): 150V; Symbol: FRC0805F2553TS; Device: FRC0805F2553TS; Supplier: LCSC; Supplier Part: C2933384; Manufacturer Part: FRC0805F2553TS; Value: 255kΩ; LCSC Part Name: 255kΩ ±1% 125mW 厚膜电阻; Supplier Footprint: 0805; JLCPCB Part Class: Extended Part; Datasheet: https://atta.szlcsc.com/upload/public/pdf/source/20211221/925EC7D7225764EE0046F22065062C87.pdf; ConvertToPcb: yes; FootprintName: R0805; Type: 厚膜电阻; Temperature Coefficient: ±100ppm/℃; Operating Temperature Range: -55℃~+155℃
R210 R215 = 0805W8F3002T5E: 电阻类型:厚膜电阻;阻值:30kΩ;精度:±1%;功率:125mW;最大工作电压:150V;温度系数:±100ppm/℃;; Manufacturer: UNI-ROYAL(厚声); AddInBom: yes; ModelId: 37a81e68749a4138bd2dfa6897b24b85; ModelName: R0805_L2.0-W1.3-H0.6; ModelTransform: 78.74,51.181,0,0,0,0,0,-0.0005,0; Tolerance: ±1%; Power(Watts): 125mW; Overload Voltage (Max): 150V; Symbol: 0805W8F3002T5E; Device: 0805W8F3002T5E; Supplier: LCSC; Manufacturer Part: 0805W8F3002T5E; Supplier Part: C17621; Value: 30kΩ; JLCPCB Part Class: 基础库; LCSC Part Name: 30kΩ ±1% 125mW 厚膜电阻; Supplier Footprint: 0805; Datasheet: https://atta.szlcsc.com/upload/public/pdf/source/20200306/C422600_1E6D84923E4A46A82E41ADD87F860B5C.pdf; ConvertToPcb: yes; FootprintName: R0805; Type: 厚膜电阻; Temperature Coefficient: ±100ppm/℃; Operating Temperature Range: -55℃~+155℃
R214 = 0805W8F2203T5E: 电阻类型:厚膜电阻;阻值:220kΩ;精度:±1%;功率:125mW;最大工作电压:150V;温度系数:±100ppm/℃;; Manufacturer: UNI-ROYAL(厚声); AddInBom: yes; ModelId: 37a81e68749a4138bd2dfa6897b24b85; ModelName: R0805_L2.0-W1.3-H0.6; ModelTransform: 78.74,51.181,0,0,0,0,0,-0.0005,0; Tolerance: ±1%; Power(Watts): 125mW; Overload Voltage (Max): 150V; Symbol: 0805W8F2203T5E; Device: 0805W8F2203T5E; Supplier: LCSC; Manufacturer Part: 0805W8F2203T5E; Supplier Part: C17556; Value: 220kΩ; JLCPCB Part Class: 基础库; LCSC Part Name: 220kΩ ±1% 125mW 厚膜电阻; Supplier Footprint: 0805; Datasheet: https://atta.szlcsc.com/upload/public/pdf/source/20200306/C422600_1E6D84923E4A46A82E41ADD87F860B5C.pdf; ConvertToPcb: yes; FootprintName: R0805; Type: 厚膜电阻; Temperature Coefficient: ±100ppm/℃; Operating Temperature Range: -55℃~+155℃
R258 = 0603WAF1002T5E: 电阻类型:厚膜电阻;阻值:10kΩ;精度:±1%;功率:100mW;最大工作电压:75V;温度系数:±100ppm/℃;; Manufacturer: UNI-ROYAL(厚声); AddInBom: yes; ModelId: fc143cca1e79419f9cd78b61e9279f08; ModelTransform: 31.8897,63.7794,0,90,0,0,0,0,0; Tolerance: ±1%; Power(Watts): 100mW; Overload Voltage (Max): 75V; Symbol: 0603WAF1002T5E; Device: 0603WAF1002T5E; Supplier: LCSC; Manufacturer Part: 0603WAF1002T5E; Supplier Part: C25804; Value: 10kΩ; JLCPCB Part Class: 基础库; LCSC Part Name: 厚膜电阻 10kΩ ±1% 100mW; Supplier Footprint: 0603; Datasheet: https://atta.szlcsc.com/upload/public/pdf/source/20200306/C422600_1E6D84923E4A46A82E41ADD87F860B5C.pdf; ConvertToPcb: yes; FootprintName: R0603; ModelName: R0603; Type: 厚膜电阻; Temperature Coefficient: ±100ppm/℃; Operating Temperature Range: -55℃~+155℃
U4 = LMZ31710RVQR: 输入电压(DC):2.95V~17V;输出电压:600mV~5.5V;输出电流(最大值):10A;转换效率:94%;; Manufacturer: TI(德州仪器); AddInBom: yes; ModelId: b405a9cc44b8472d8e387364c04e6973; ModelName: B3QFN-42_L10.0-W10.0-H4.3-P0.80-TL-EP; ModelTransform: 394.487,394.487,0,270,0,0,-0.002,-0.001,0; Output Current (Max): 10A; Output Channel: 1; Conversion Efficiency: 94%; Symbol: LMZ31710RVQR; Device: LMZ31710RVQR; LCSC Part Name: LMZ31710RVQR; SupplierPart: C840112; ManufacturerPart: LMZ31710RVQR; Supplier Footprint: B3QFN-42(10x10); Datasheet: https://www.ti.com/cn/lit/gpn/lmz31710; Supplier: LCSC; ConvertToPcb: yes; FootprintName: B3QFN-42_L10.0-W10.0-P0.80-TL-EP; Input Voltage(DC): 2.95V~17V; Output Voltage: 600mV~5.5V
U47 = EA3059C: 电源电压:2.7V~5.5V;最大充电电流:3A;电池类型:-;电池节数:3;; Manufacturer: everanalog(申风); AddInBom: yes; ModelId: 1e6a51e223ba431598528b34e5bdfcc9; ModelName: QFN-24_L4.0-W4.0-H0.9-P0.50; ModelTransform: 157.48,157.48,0,90,0,0,0,0,0; Maximum Charge Current: 3A; Number of Cells: 3; Symbol: EA3059C; Device: EA3059C; LCSC Part Name: EA3059C; SupplierPart: C570858; ManufacturerPart: EA3059C; Supplier Footprint: QFN-24-EP(4x4); Datasheet: https://atta.szlcsc.com/upload/public/pdf/source/20200529/C570858_02004577BC1B4FB0D7AD64ADE75AE9D5.pdf; Supplier: LCSC; ConvertToPcb: yes; FootprintName: QFN-24_L4.0-W4.0-P0.50-BL-EP2.6; The Chip Type: -; Supply Voltage: 2.7V~5.5V; Charging Saturation Voltage: -; End-Off Voltage: -; Type of Battery: -; Operating Temperature: -
U57 U58 U63 U71 = FWP252012P-1R5ML: 电感值:1.5uH;精度:±20%;额定电流:2.5A;饱和电流(Isat):3.2A;类型:一体成型电感;; Manufacturer: cjiang(长江微电); AddInBom: yes; ModelId: b00ab518ea734306a4827888fb14b830; ModelTransform: 99.2124,78.74,0,0,0,0,0,0,0; Tolerance: ±20%; Rated Current: 2.5A; Saturation Current (Isat): 3.2A; DC Resistance (DCR): 64mΩ; Symbol: FWP252012P-1R5ML; Device: FWP252012P-1R5ML; LCSC Part Name: 1.5uH ±20% 3.2A; SupplierPart: C5179445; ManufacturerPart: FWP252012P-1R5ML; Supplier Footprint: 1008; JLCPCB Part Class: Extended Part; Datasheet: https://atta.szlcsc.com/upload/public/pdf/source/20221101/26FA6D12DC906E6E20315A6F9826B4BB.pdf; Supplier: LCSC; ConvertToPcb: yes; FootprintName: IND-SMD_L2.5-W2.0_YXMBL252010P; ModelName: IND-SMD_L2.5-W2.0_YXMBL252010P; Value: 1.5uH; Type: 一体成型电感
U59 = TPS564257DRLR: TPS564257 3V 至 17V 输入电压、4A FCCM 模式、同步降压转换器; Manufacturer: TI(德州仪器); AddInBom: yes; ModelId: 6c48915c55ca481897faee5dfab5b527; ModelName: SOT-563-6_L1.6-W1.2-P0.5-LS1.6-BL; ModelTransform: 62.992,62.992,0,90,0,0,0,0,0; Symbol: TPS564257DRLR; Device: TPS564257DRLR; LCSC Part Name: 3V 至 17V 输入电压、4A FCCM 模式、同步降压转换器; SupplierPart: C19272233; ManufacturerPart: TPS564257DRLR; Supplier Footprint: SOT-563; JLCPCB Part Class: 扩展库; Datasheet: https://atta.szlcsc.com/upload/public/pdf/source/20231201/0D7B83C97162ADC0E69234A3FF5FC8E6.pdf; Supplier: LCSC; ConvertToPcb: yes; FootprintName: SOT-563-6_L1.6-W1.2-P0.5-LS1.6-BR
U60 = FTC252010S4R7MBCA: 电感值:4.7uH;精度:±20%;额定电流:2A;饱和电流(Isat):2.6A;类型:一体成型电感;; Manufacturer: cjiang(长江微电); AddInBom: yes; ModelId: e143e04106934774881cec608355723f; ModelTransform: 98.504,78.819,0,0,0,0,-0.004,-0.003,0; Tolerance: ±20%; Rated Current: 2A; Saturation Current (Isat): 2.6A; DC Resistance (DCR): 160mΩ; Symbol: FTC252010S4R7MBCA; Device: FTC252010S4R7MBCA; LCSC Part Name: 4.7uH ±20% 2.6A; SupplierPart: C5832360; ManufacturerPart: FTC252010S4R7MBCA; Supplier Footprint: SMD,2x2.5mm; JLCPCB Part Class: 扩展库; Datasheet: https://atta.szlcsc.com/upload/public/pdf/source/20230602/8FFEDA9C0247A92A0D4B67554BFE4091.pdf; Supplier: LCSC; ConvertToPcb: yes; FootprintName: IND-SMD_L2.5-W2.0-VLS252012CX-150M; ModelName: IND-SMD_L2.5-W2.0-VLS252012CX-150M; Value: 4.7uH; Type: 一体成型电感
U61 U62 = FRC1812F0000TS: 电阻类型:厚膜电阻;阻值:0Ω;精度:±1%;功率:750mW;最大工作电压:200V;; Manufacturer: FOJAN(富捷); AddInBom: yes; ModelId: af694575e3ed47d88275f413b27c3748; ModelName: R1812_L4.5-W3.2-H0.6; ModelTransform: 177.165,125.984,0,0,0,0,0.0005,0,0; Tolerance: ±1%; Power(Watts): 750mW; Overload Voltage (Max): 200V; Symbol: FRC1812F0000TS; Device: FRC1812F0000TS; LCSC Part Name: 0Ω ±1% 750mW 厚膜电阻; SupplierPart: C2999613; ManufacturerPart: FRC1812F0000TS; Supplier Footprint: 1812; JLCPCB Part Class: 扩展库; Datasheet: https://atta.szlcsc.com/upload/public/pdf/source/20211221/925EC7D7225764EE0046F22065062C87.pdf; Supplier: LCSC; ConvertToPcb: yes; FootprintName: R1812; Type: 厚膜电阻; Value: 0Ω
U70 = RT0603BRE072K15L: 电阻类型:薄膜电阻;阻值:2.15kΩ;精度:±0.1%;功率:100mW;温度系数:±50ppm/℃;; Manufacturer: YAGEO(国巨); AddInBom: yes; ModelId: fc143cca1e79419f9cd78b61e9279f08; ModelTransform: 31.8897,63.7794,0,90,0,0,0,0,0; Tolerance: ±0.1%; Power(Watts): 100mW; Symbol: RT0603BRE072K15L; Device: RT0603BRE072K15L; LCSC Part Name: 薄膜电阻 2.15kΩ ±0.1% 100mW; SupplierPart: C861809; ManufacturerPart: RT0603BRE072K15L; Supplier Footprint: 0603; JLCPCB Part Class: 扩展库; Datasheet: https://atta.szlcsc.com/upload/public/pdf/source/20200610/C326738_5639A9F1B6EB6E4AE2197577D3456E7F.pdf; Supplier: LCSC; ConvertToPcb: yes; FootprintName: R0603; ModelName: R0603; Type: 薄膜电阻; Value: 2.15kΩ; Temperature Coefficient: ±50ppm/℃; Operating Temperature Range: -55℃~+155℃